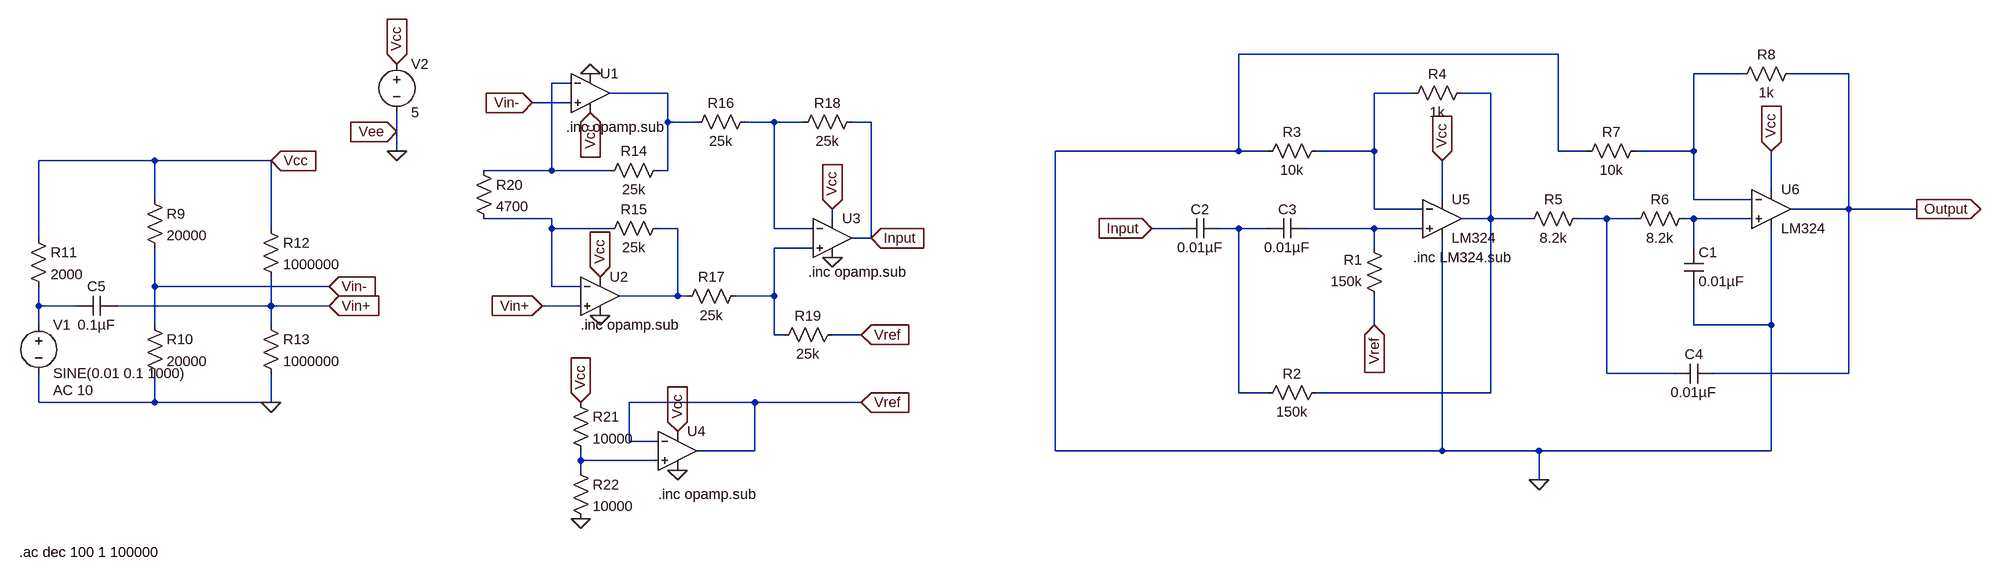
[diagram p0: schematic full_circuit.asc]
full_circuit.asc, the LTspice schematic file:
Version 4
SHEET 1 880 680
WIRE 32 -432 -496 -432
WIRE 336 -400 256 -400
WIRE 512 -400 416 -400
WIRE -1600 -384 -1632 -384
WIRE -1440 -368 -1536 -368
WIRE -208 -368 -272 -368
WIRE -80 -368 -128 -368
WIRE -1600 -352 -1664 -352
WIRE -1440 -320 -1440 -368
WIRE -1392 -320 -1440 -320
WIRE -1264 -320 -1312 -320
WIRE -1216 -320 -1264 -320
WIRE -1104 -320 -1136 -320
WIRE -1888 -304 -1888 -336
WIRE -1888 -272 -1888 -304
WIRE -496 -272 -496 -432
WIRE -496 -272 -800 -272
WIRE -448 -272 -496 -272
WIRE -272 -272 -272 -368
WIRE -272 -272 -368 -272
WIRE 32 -272 32 -432
WIRE 80 -272 32 -272
WIRE 256 -272 256 -400
WIRE 256 -272 160 -272
WIRE -2288 -256 -2480 -256
WIRE -2096 -256 -2288 -256
WIRE -1632 -240 -1632 -384
WIRE -1632 -240 -1744 -240
WIRE -1536 -240 -1632 -240
WIRE -1440 -240 -1440 -320
WIRE -1440 -240 -1456 -240
WIRE 384 -208 384 -272
WIRE -2288 -192 -2288 -256
WIRE -160 -192 -160 -256
WIRE 256 -192 256 -272
WIRE 352 -192 256 -192
WIRE -272 -176 -272 -272
WIRE -192 -176 -272 -176
WIRE 512 -176 512 -400
WIRE 512 -176 416 -176
WIRE 624 -176 512 -176
WIRE -1632 -160 -1744 -160
WIRE -1168 -160 -1168 -176
WIRE -80 -160 -80 -368
WIRE -80 -160 -128 -160
WIRE -16 -160 -80 -160
WIRE 112 -160 64 -160
WIRE 160 -160 112 -160
WIRE 256 -160 240 -160
WIRE 352 -160 256 -160
WIRE -2096 -144 -2096 -256
WIRE -1632 -144 -1632 -160
WIRE -1536 -144 -1632 -144
WIRE -1424 -144 -1456 -144
WIRE -1264 -144 -1264 -320
WIRE -1200 -144 -1264 -144
WIRE -592 -144 -640 -144
WIRE -496 -144 -528 -144
WIRE -448 -144 -496 -144
WIRE -272 -144 -384 -144
WIRE -192 -144 -272 -144
WIRE -2480 -128 -2480 -256
WIRE -1104 -128 -1104 -320
WIRE -1104 -128 -1136 -128
WIRE -1200 -112 -1264 -112
WIRE -272 -112 -272 -144
WIRE 256 -112 256 -160
WIRE -2288 -48 -2288 -112
WIRE -2000 -48 -2288 -48
WIRE -1632 -48 -1632 -144
WIRE -1584 -48 -1632 -48
WIRE -1424 -32 -1424 -144
WIRE -1424 -32 -1520 -32
WIRE -1408 -32 -1424 -32
WIRE -1264 -32 -1264 -112
WIRE -1264 -32 -1328 -32
WIRE -2480 -16 -2480 -48
WIRE -2416 -16 -2480 -16
WIRE -2096 -16 -2096 -64
WIRE -2096 -16 -2352 -16
WIRE -2000 -16 -2096 -16
WIRE -1584 -16 -1648 -16
WIRE -2480 16 -2480 -16
WIRE -2288 16 -2288 -48
WIRE -2096 16 -2096 -16
WIRE -272 16 -272 -32
WIRE 256 16 256 -48
WIRE 384 16 384 -144
WIRE 384 16 256 16
WIRE -1264 32 -1264 -32
WIRE -1248 32 -1264 32
WIRE -1120 32 -1168 32
WIRE 112 96 112 -160
WIRE 224 96 112 96
WIRE 512 96 512 -176
WIRE 512 96 288 96
WIRE -496 128 -496 -144
WIRE -448 128 -496 128
WIRE -80 128 -80 -160
WIRE -80 128 -368 128
WIRE -2480 144 -2480 96
WIRE -2288 144 -2288 96
WIRE -2288 144 -2480 144
WIRE -2096 144 -2096 96
WIRE -2096 144 -2288 144
WIRE -1296 144 -1504 144
WIRE -1120 144 -1296 144
WIRE -1504 208 -1504 144
WIRE -1456 208 -1504 208
WIRE -1296 224 -1296 144
WIRE -1296 224 -1392 224
WIRE -800 224 -800 -272
WIRE -160 224 -160 -128
WIRE -160 224 -800 224
WIRE 0 224 -160 224
WIRE 384 224 384 16
WIRE 384 224 0 224
WIRE -1584 240 -1584 224
WIRE -1456 240 -1584 240
WIRE -1584 256 -1584 240
WIRE 0 272 0 224
FLAG -1888 -416 Vcc
IOPIN -1888 -416 In
FLAG -2000 -16 Vin+
IOPIN -2000 -16 In
FLAG -2096 -256 Vcc
IOPIN -2096 -256 In
FLAG -2096 144 0
FLAG -1168 -176 Vcc
IOPIN -1168 -176 In
FLAG -1888 -272 0
FLAG -1888 -304 Vee
IOPIN -1888 -304 In
FLAG -1568 -336 Vcc
IOPIN -1568 -336 In
FLAG -1552 -64 Vcc
IOPIN -1552 -64 In
FLAG -1584 144 Vcc
IOPIN -1584 144 In
FLAG -1424 192 Vcc
IOPIN -1424 192 In
FLAG -1424 256 0
FLAG -1168 -96 0
FLAG -1648 -16 Vin+
IOPIN -1648 -16 In
FLAG -1584 336 0
FLAG -1568 -400 0
FLAG -1552 0 0
FLAG -2000 -48 Vin-
IOPIN -2000 -48 In
FLAG -1664 -352 Vin-
IOPIN -1664 -352 In
FLAG 384 -272 Vcc
IOPIN 384 -272 In
FLAG 624 -176 Output
IOPIN 624 -176 Out
FLAG -160 -256 Vcc
IOPIN -160 -256 In
FLAG -640 -144 Input
IOPIN -640 -144 In
FLAG -272 16 Vref
IOPIN -272 16 In
FLAG 0 272 0
FLAG -1104 -128 Input
IOPIN -1104 -128 In
FLAG -1120 144 Vref
IOPIN -1120 144 In
FLAG -1120 32 Vref
IOPIN -1120 32 In
SYMBOL res -2304 -208 R0
SYMATTR InstName R9
SYMATTR Value 20000
SYMBOL res -2304 0 R0
SYMATTR InstName R10
SYMATTR Value 20000
SYMBOL res -2496 -144 R0
SYMATTR InstName R11
SYMATTR Value 2000
SYMBOL res -2112 -160 R0
SYMATTR InstName R12
SYMATTR Value 1000000
SYMBOL res -2112 0 R0
SYMATTR InstName R13
SYMATTR Value 1000000
SYMBOL voltage -2480 0 R0
WINDOW 123 24 124 Left 2
WINDOW 39 0 0 Left 0
SYMATTR Value2 AC 10
SYMATTR InstName V1
SYMATTR Value SINE(0.01 0.1 1000)
SYMBOL cap -2352 -32 R90
WINDOW 0 0 32 VBottom 2
WINDOW 3 32 32 VTop 2
SYMATTR InstName C5
SYMATTR Value 0.1µF
SYMBOL voltage -1888 -432 R0
WINDOW 123 0 0 Left 0
WINDOW 39 0 0 Left 0
SYMATTR InstName V2
SYMATTR Value 5
SYMBOL res -1440 -256 R90
WINDOW 0 0 56 VBottom 2
WINDOW 3 32 56 VTop 2
SYMATTR InstName R14
SYMATTR Value 25k
SYMBOL res -1440 -160 R90
WINDOW 0 0 56 VBottom 2
WINDOW 3 32 56 VTop 2
SYMATTR InstName R15
SYMATTR Value 25k
SYMBOL res -1296 -336 R90
WINDOW 0 0 56 VBottom 2
WINDOW 3 32 56 VTop 2
SYMATTR InstName R16
SYMATTR Value 25k
SYMBOL res -1312 -48 R90
WINDOW 0 0 56 VBottom 2
WINDOW 3 32 56 VTop 2
SYMATTR InstName R17
SYMATTR Value 25k
SYMBOL res -1120 -336 R90
WINDOW 0 0 56 VBottom 2
WINDOW 3 32 56 VTop 2
SYMATTR InstName R18
SYMATTR Value 25k
SYMBOL res -1152 16 R90
WINDOW 0 0 56 VBottom 2
WINDOW 3 32 56 VTop 2
SYMATTR InstName R19
SYMATTR Value 25k
SYMBOL res -1600 128 R0
SYMATTR InstName R21
SYMATTR Value 10000
SYMBOL res -1600 240 R0
SYMATTR InstName R22
SYMATTR Value 10000
SYMBOL res -1760 -256 R0
SYMATTR InstName R20
SYMATTR Value 4700
SYMBOL cap 240 -112 R0
SYMATTR InstName C1
SYMATTR Value 0.01µF
SYMBOL cap -528 -160 R90
WINDOW 0 0 32 VBottom 2
WINDOW 3 32 32 VTop 2
SYMATTR InstName C2
SYMATTR Value 0.01µF
SYMBOL cap -384 -160 R90
WINDOW 0 0 32 VBottom 2
WINDOW 3 32 32 VTop 2
SYMATTR InstName C3
SYMATTR Value 0.01µF
SYMBOL res -256 -16 R180
WINDOW 0 36 76 Left 2
WINDOW 3 36 40 Left 2
SYMATTR InstName R1
SYMATTR Value 150k
SYMBOL res -352 112 R90
WINDOW 0 0 56 VBottom 2
WINDOW 3 32 56 VTop 2
SYMATTR InstName R2
SYMATTR Value 150k
SYMBOL res -352 -288 R90
WINDOW 0 0 56 VBottom 2
WINDOW 3 32 56 VTop 2
SYMATTR InstName R3
SYMATTR Value 10k
SYMBOL res -112 -384 R90
WINDOW 0 0 56 VBottom 2
WINDOW 3 32 56 VTop 2
SYMATTR InstName R4
SYMATTR Value 1k
SYMBOL res 80 -176 R90
WINDOW 0 0 56 VBottom 2
WINDOW 3 32 56 VTop 2
SYMATTR InstName R5
SYMATTR Value 8.2k
SYMBOL res 256 -176 R90
WINDOW 0 0 56 VBottom 2
WINDOW 3 32 56 VTop 2
SYMATTR InstName R6
SYMATTR Value 8.2k
SYMBOL res 176 -288 R90
WINDOW 0 0 56 VBottom 2
WINDOW 3 32 56 VTop 2
SYMATTR InstName R7
SYMATTR Value 10k
SYMBOL res 432 -416 R90
WINDOW 0 0 56 VBottom 2
WINDOW 3 32 56 VTop 2
SYMATTR InstName R8
SYMATTR Value 1k
SYMBOL cap 288 80 R90
WINDOW 0 0 32 VBottom 2
WINDOW 3 32 32 VTop 2
SYMATTR InstName C4
SYMATTR Value 0.01µF
SYMBOL OpAmps\\UniversalOpAmp -1568 -368 R0
SYMATTR InstName U1
SYMBOL OpAmps\\UniversalOpAmp -1552 -32 R0
SYMATTR InstName U2
SYMBOL OpAmps\\UniversalOpAmp -1168 -128 R0
SYMATTR InstName U3
SYMBOL OpAmps\\UniversalOpAmp -1424 224 R0
SYMATTR InstName U4
SYMBOL LM324 -160 -224 R0
SYMATTR InstName U5
SYMBOL LM324 384 -240 R0
SYMATTR InstName U6
TEXT -2512 392 Left 2 !.ac dec 100 1 100000
TEXT -1608 -312 Left 2 !.inc opamp.sub
TEXT -1208 -72 Left 2 !.inc opamp.sub
TEXT -1584 16 Left 2 !.inc opamp.sub
TEXT -1456 296 Left 2 !.inc opamp.sub
TEXT -208 -96 Left 2 !.inc LM324.sub

The netlist it stands for:
* full_circuit.asc
R9 Vcc Vin- 20000
R10 Vin- 0 20000
R11 Vcc N014 2000
R12 Vcc Vin+ 1000000
R13 Vin+ 0 1000000
V1 N014 0 SINE(0.01 0.1 1000) AC 10
C5 Vin+ N014 0.1µF
V2 Vcc 0 5
R14 N003 N002 25k
R15 N010 N007 25k
R16 N006 N003 25k
R17 N013 N010 25k
R18 Input N006 25k
R19 Vref N013 25k
R21 Vcc N015 10000
R22 N015 0 10000
R20 N002 N007 4700
C1 N009 0 0.01µF
C2 N011 Input 0.01µF
C3 N012 N011 0.01µF
R1 Vref N012 150k
R2 N005 N011 150k
R3 N004 0 10k
R4 N005 N004 1k
R5 N008 N005 8.2k
R6 N009 N008 8.2k
R7 N001 0 10k
R8 Output N001 1k
C4 Output N008 0.01µF
XU1 Vin- N002 0 Vcc N003 level1 Avol=1Meg GBW=10Meg Vos=0 En=0 Enk=0 In=0 Ink=0 Rin=500Meg  ; pins In+ In- V+ V- OUT
XU2 Vin+ N007 Vcc 0 N010 level1 Avol=1Meg GBW=10Meg Vos=0 En=0 Enk=0 In=0 Ink=0 Rin=500Meg  ; pins In+ In- V+ V- OUT
XU3 N013 N006 Vcc 0 Input level1 Avol=1Meg GBW=10Meg Vos=0 En=0 Enk=0 In=0 Ink=0 Rin=500Meg  ; pins In+ In- V+ V- OUT
XU4 N015 Vref Vcc 0 Vref level1 Avol=1Meg GBW=10Meg Vos=0 En=0 Enk=0 In=0 Ink=0 Rin=500Meg  ; pins In+ In- V+ V- OUT
* U5: LM324 (symbol LM324 not available, pins judged from their places): In+=N012 In-=N004 V+=Vcc V-=0 OUT=N005
* U6: LM324 (symbol LM324 not available, pins judged from their places): In+=N009 In-=N001 V+=Vcc V-=0 OUT=Output
.ac dec 100 1 100000
.inc opamp.sub
.inc opamp.sub
.inc opamp.sub
.inc opamp.sub
.inc LM324.sub
.lib UniversalOpAmp1.lib
.backanno
.end